# EAGLE design elm329 (EAGLE 7.6.0)
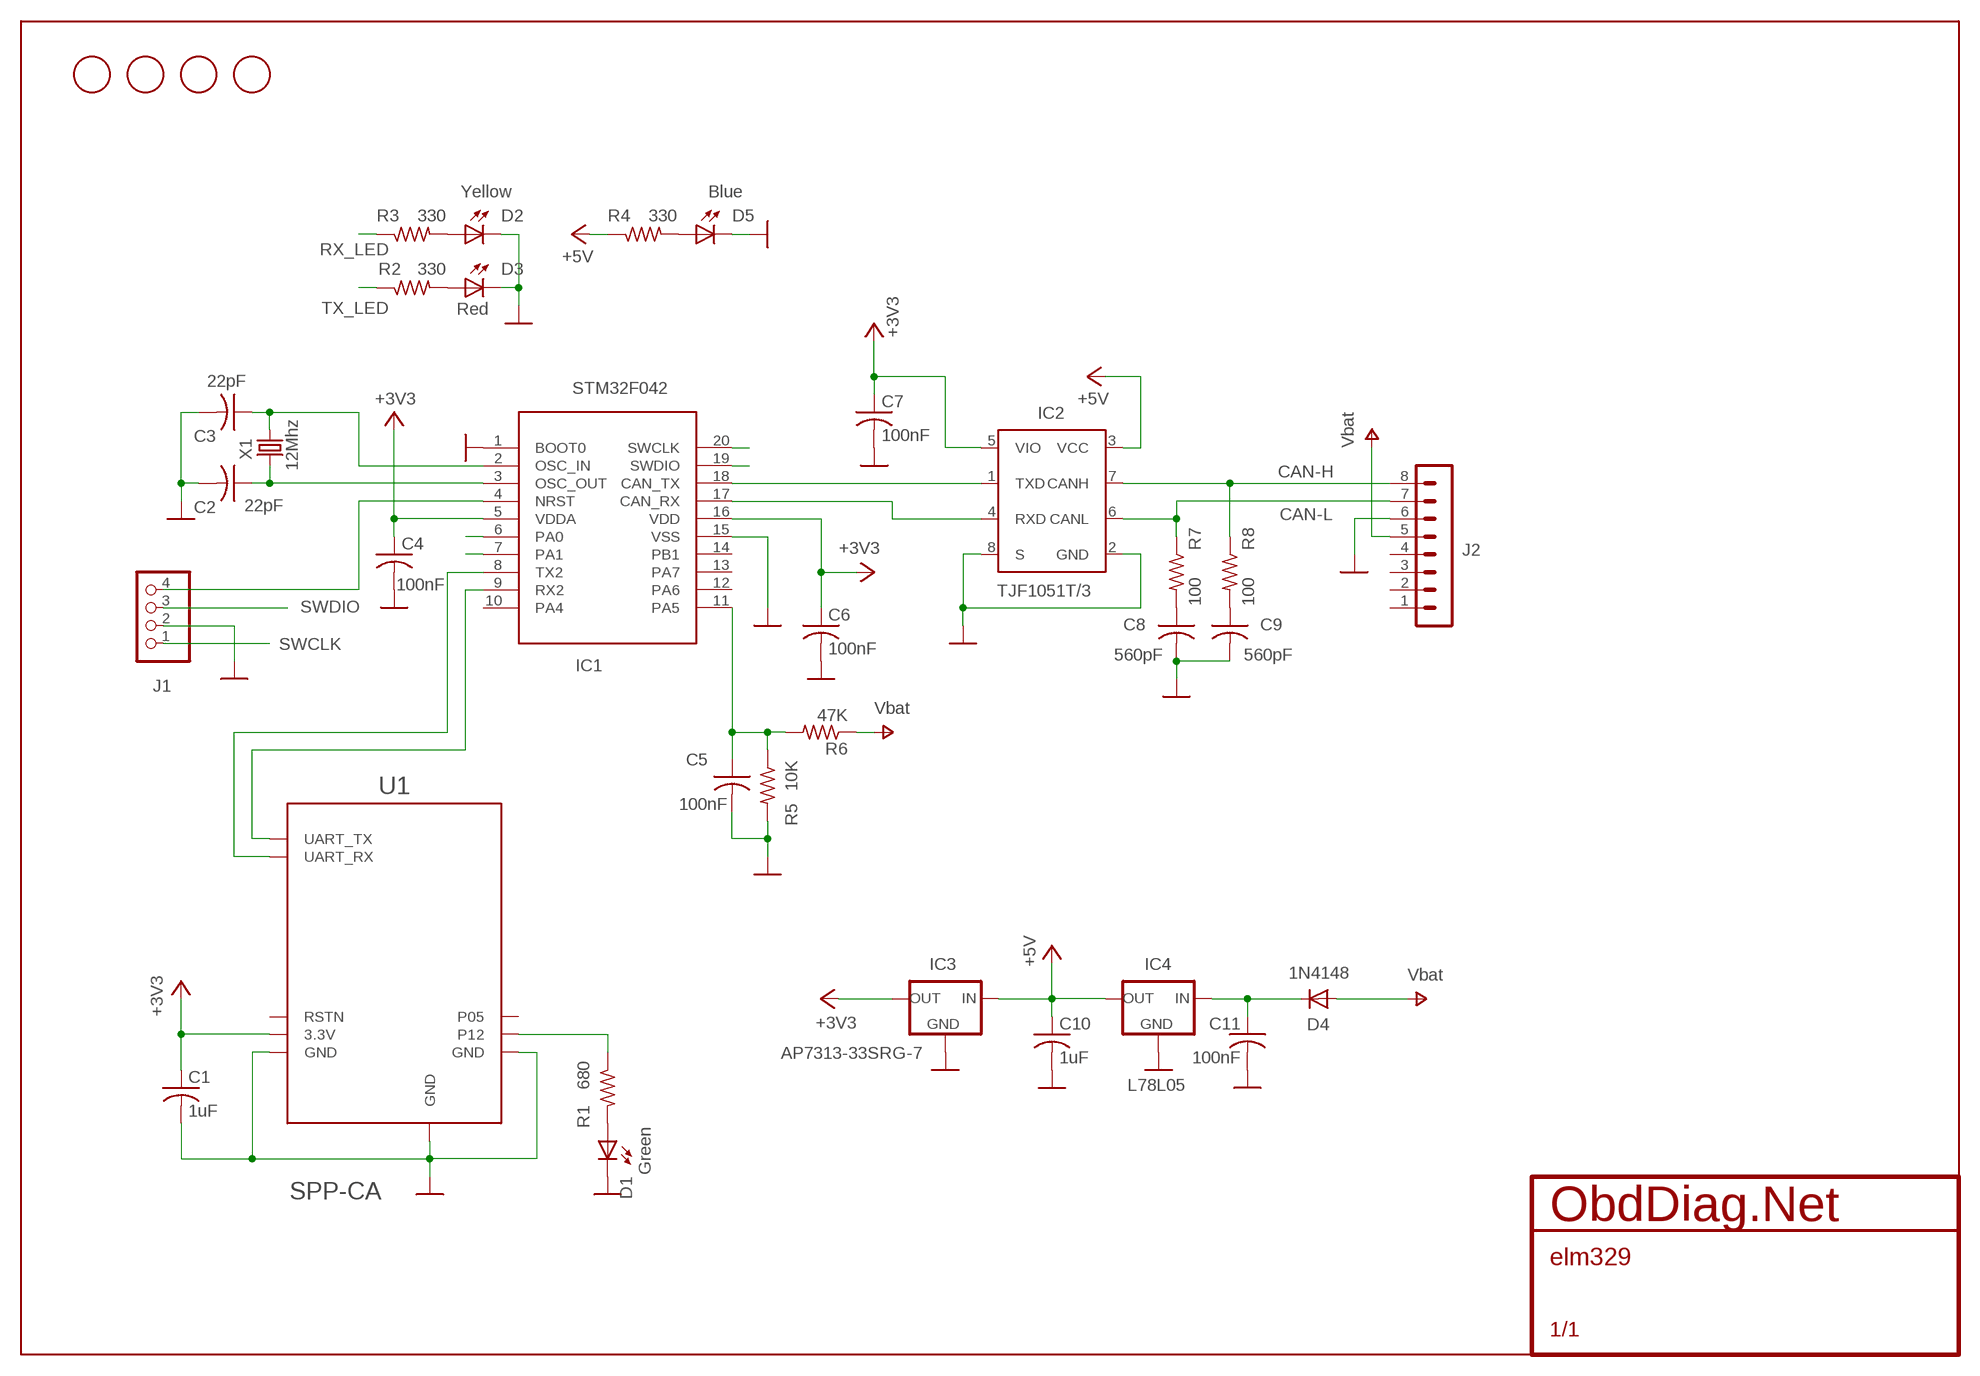
[diagram p0: schematic, sheet 1]

## Parts
C1  1uF  C-USC0805  [C0805]
C2  22pF  C-USC0805  [C0805]
C3  22pF  C-USC0805  [C0805]
C4  100nF  C-USC0805  [C0805]
C5  100nF  C-USC0805  [C0805]
C6  100nF  C-USC0805  [C0805]
C7  100nF  C-USC0805  [C0805]
C8  560pF  C-USC0805  [C0805]
C9  560pF  C-USC0805  [C0805]
C10  1uF  C-USC0805  [C0805]
C11  100nF  C-USC0805  [C0805]
D1  Green  LEDCHIPLED_0805  [CHIPLED_0805]
D2  Yellow  LEDCHIPLED_0805  [CHIPLED_0805]
D3  Red  LEDCHIPLED_0805  [CHIPLED_0805]
D4  1N4148  1N4148W  [SOD123]
D5  Blue  LEDCHIPLED_0805  [CHIPLED_0805]
IC1  STM32F042  STM32F042-TSSOP  [TSSOP20]
IC2  TJF1051T/3  TJF1051  [SO-8]
IC3  AP7313-33SRG-7  MCP1700-SOT23  [SOT23]
IC4  L78L05  L78LXX-SOT89  [SOT89R]
J1  1X04  1X04SMALL  [1X04]
J2  MA08-1  [MA08-1]
R1  680  R-US_R0805  [R0805]
R2  330  R-US_R0805  [R0805]
R3  330  R-US_R0805  [R0805]
R4  330  R-US_R0805  [R0805]
R5  10K  R-US_R0805  [R0805]
R6  47K  R-US_R0805  [R0805]
R7  100  R-US_R0805  [R0805]
R8  100  R-US_R0805  [R0805]
U1  SPP-CA  [HM-10_16]
U$1  FIDUCIAL  [FIDUCIAL_1MM]
U$2  FIDUCIAL  [FIDUCIAL_1MM]
U$4  FIDUCIAL  [FIDUCIAL_1MM]
U$5  FIDUCIAL  [FIDUCIAL_1MM]
X1  12Mhz  CRYSTALSM49  [SM49]

## Nets
+3V3: C1.1 C4.1 C6.1 C7.1 IC1.5(VDDA) IC1.16(VDD) IC2.5(VIO) IC3.2(OUT) U1.12(3.3V)
+5V: C10.1 IC2.3(VCC) IC3.3(IN) IC4.2(OUT) R4.1
CAN-H: IC2.7(CANH) J2.8 R8.1
CAN-L: IC2.6(CANL) J2.7 R7.1
CAN_RX1: IC1.17(CAN_RX) IC2.4(RXD)
GND: C1.2 C2.2 C3.2 C4.2 C5.2 C6.2 C7.2 C8.2 C9.2 C10.2 C11.2 D1.C D2.C D3.C D5.C IC1.1(BOOT0) IC1.15(VSS) IC2.2(GND) IC2.8(S) IC3.1(GND) IC4.4(GND) J1.2 J2.6 R5.2 U1.13(GND) U1.21(GND) U1.22(GND)
N$1: D1.A R1.2
N$2: C2.1 IC1.3(OSC_OUT) X1.2
N$3: IC1.4(NRST) J1.4
N$4: R1.1 U1.24(P12)
N$5: C3.1 IC1.2(OSC_IN) X1.1
N$6: IC1.18(CAN_TX) IC2.1(TXD)
N$7: D5.A R4.2
N$9: IC1.9(RX2) U1.1(UART_TX)
N$10: D2.A R3.2
N$11: D3.A R2.2
N$12: C11.1 D4.C IC4.1(IN)
N$14: IC1.8(TX2) U1.2(UART_RX)
N$16: C9.1 R8.2
N$17: C8.1 R7.2
P0_0: C5.1 IC1.11(PA5) R5.1 R6.2
RX_LED: IC1.7(PA1) R3.1
SWCLK: IC1.20(SWCLK) J1.1
SWDIO: IC1.19(SWDIO) J1.3
TX_LED: IC1.6(PA0) R2.1
V+: D4.A J2.5 R6.1 ; supply symbol labelled Vbat
Unconnected: IC1.10(PA4) IC1.12(PA6) IC1.13(PA7) IC1.14(PB1) J2.1 J2.2 J2.3 J2.4 U1.11(RSTN) U1.25(P05)

## Library data of the parts
C1-C11 = rcl:C-US: CAPACITOR, American symbol
D1-D3 D5 = led:LED: LED OSRAM: - CHIPLED LG R971, LG N971, LY N971, LG Q971, LY Q971, LO R971, LY R971 LH N974, LH R974 LS Q976, LO Q976, LY Q976 LO Q996 - Hyper CHIPLED LW Q18S LB Q993, LB Q99A, LB R99A - SideLED LS A670, LO A670, LY A670, LG A670, LP A670 LB A673, LV A673, LT A673, LW A673 LH A674 LY A675 LS A676, LA A676, LO A676, LY A676, LW A676 LS A679, LY A679, LG A679 - Hyper Micro SIDELED® LS Y876, LA Y876, LO Y876, LY Y876 LT Y87S - SmartLED LW L88C, LW L88S LB L89C, LB L89S, LG L890 LS L89K, LO L89K, LY L89K LS L896, LA L896, LO L896, LY L896 - TOPLED LS T670, LO T670, LY T670, LG T670, LP T670 LSG T670, LSP T670, LSY T670, LOP T670, LYG T670 LG T671, LOG T671, LSG T671 LB T673, LV T673, LT T673, LW T673 LH T674 LS T676, LA T676, LO T676, LY T676, LB T676, LH T676, LSB T676, LW T676 LB T67C, LV T67C, LT T67C, LS T67K, LO T67K, LY T67K, LW E67C LS E67B, LA E67B, LO E67B, LY E67B, LB E67C, LV E67C, LT E67C LW T67C LS T679, LY T679, LG T679 LS T770, LO T770, LY T770, LG T770, LP T770 LB T773, LV T773, LT T773, LW T773 LH T774 LS E675, LA E675, LY E675, LS T675 LS T776, LA T776, LO T776, LY T776, LB T776 LHGB T686 LT T68C, LB T68C - Hyper Mini TOPLED® LB M676 - Mini TOPLED Santana® LG M470 LS M47K, LO M47K, LY M47K Source: http://www.osram.convergy.de LUXEON: - LUMILED® LXK2-PW12-R00, LXK2-PW12-S00, LXK2-PW14-U00, LXK2-PW14-V00 LXK2-PM12-R00, LXK2-PM12-S00, LXK2-PM14-U00 LXK2-PE12-Q00, LXK2-PE12-R00, LXK2-PE12-S00, LXK2-PE14-T00, LXK2-PE14-U00 LXK2-PB12-K00, LXK2-PB12-L00, LXK2-PB12-M00, LXK2-PB14-N00, LXK2-PB14-P00, LXK2-PB14-Q00 LXK2-PR12-L00, LXK2-PR12-M00, LXK2-PR14-Q00, LXK2-PR14-R00 LXK2-PD12-Q00, LXK2-PD12-R00, LXK2-PD12-S00 LXK2-PH12-R00, LXK2-PH12-S00 LXK2-PL12-P00, LXK2-PL12-Q00, LXK2-PL12-R00 Source: www.luxeon.com KINGBRIGHT: KA-3528ASYC Source: www.kingbright.com
D4 = obddiag-net:1N4148W
IC1 = st:STM32F042-TSSOP
IC2 = obddiag-net:TJF1051
IC3 = obddiag-net:MCP1700
IC4 = obddiag-net:L78LXX-SOT89
J1 = obddiag-net:1X04
J2 = obddiag-net:MA08-1
R1-R8 = rcl:R-US_: RESISTOR, American symbol
U1 = obddiag-net:SPP-CA
U$1 U$2 U$4 U$5 = adafruit:FIDUCIAL: For use by pick and place machines to calibrate the vision/machine, 1mm By microbuilder.eu
X1 = crystal:CRYSTAL: CRYSTAL; OC_FARNELL: unknown; OC_NEWARK: unknown

## Board
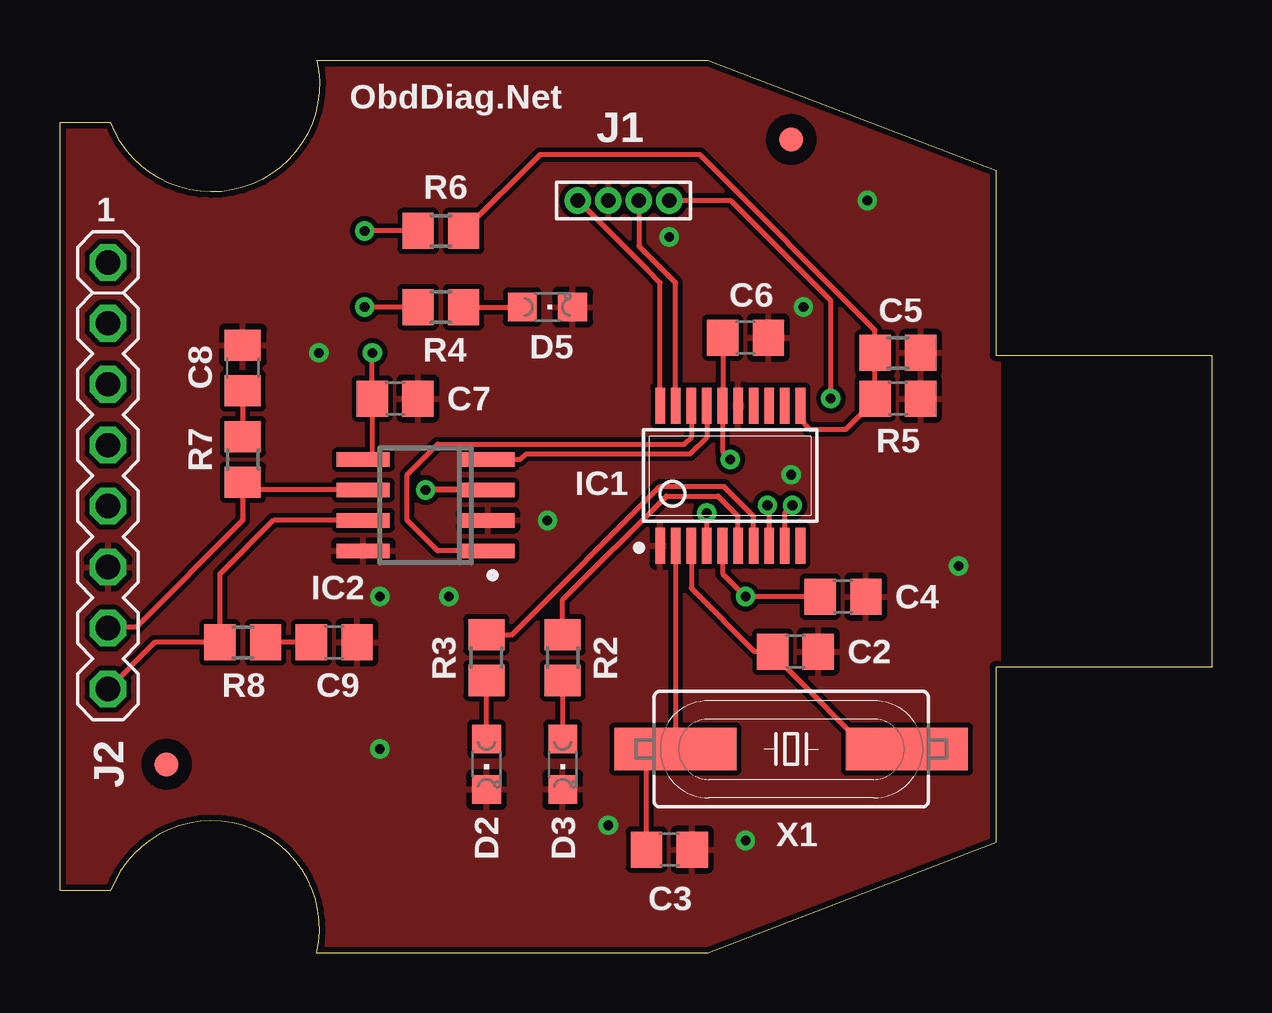
[diagram p1: board, top side]
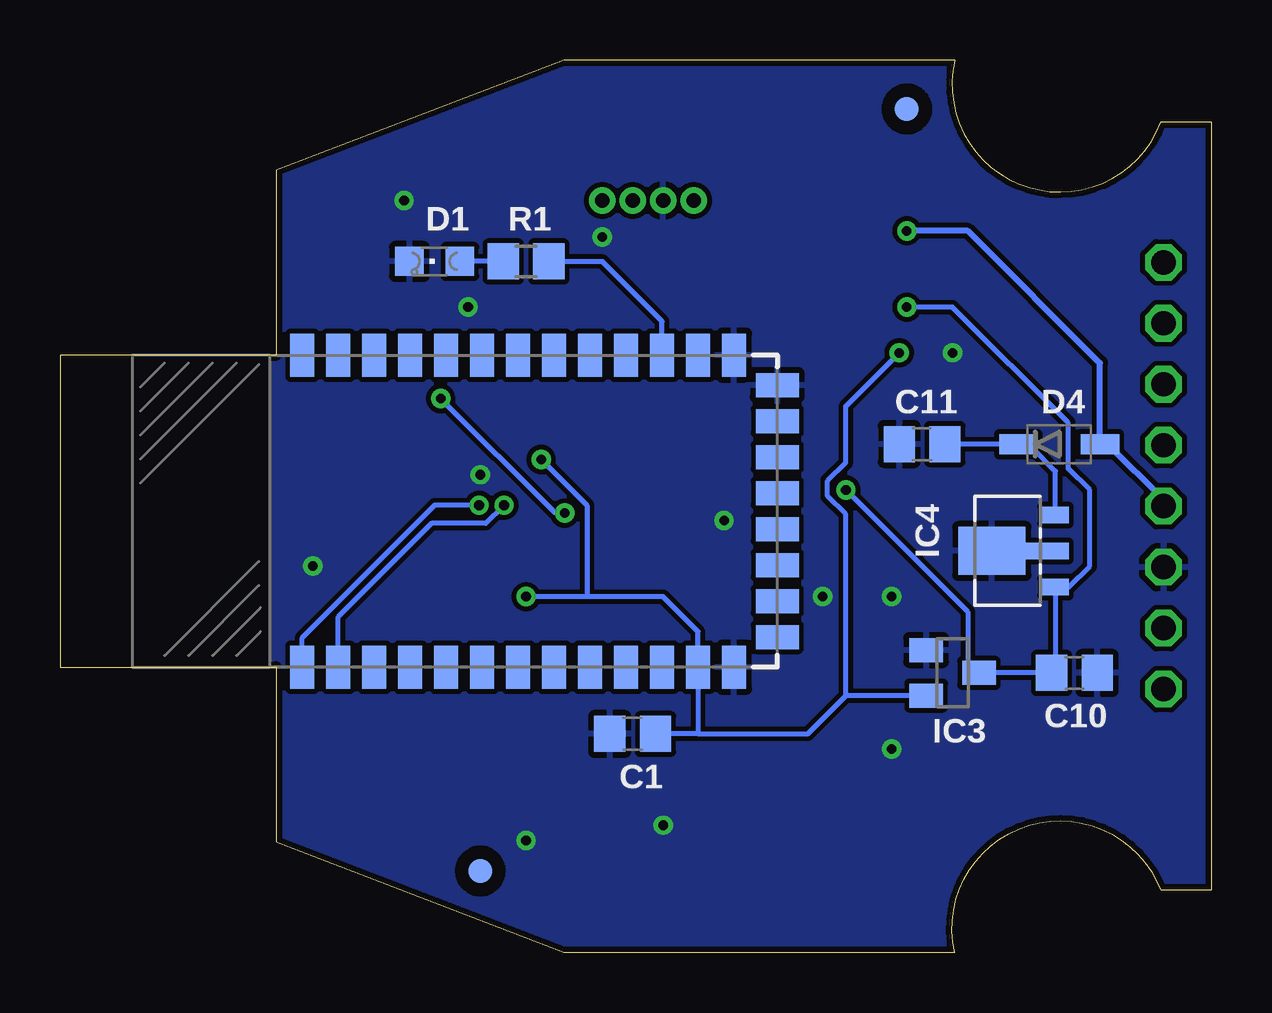
[diagram p2: board, bottom side, seen from below]

Size 48 x 37.2 mm. Coordinates in mm from the lower left corner, seen from the top.
Outline: 10.71,0 27,0 39,4.6 39,11.9 48,11.9 48,24.9 39,24.9 39,32.6 27,37.2 10.71,37.2 arc-172 2.11,34.6 0,34.6 0,2.6 2.11,2.6 arc-172 10.71,0
Copper layers (1*16): Top 1mil / dielectric 20mil / Bottom 1mil
Design rules "default *": minimum track width 8mil, minimum drill 0.4mm, track to track 8mil, track to pad 8mil, pad to pad 5mil, via to via 8mil, smd to smd 5mil, copper to edge 10mil, drill to drill 8mil, minimum pad ring 10mil, minimum via ring 8mil, stop-mask expansion 4mil, vias tented up to drill 0mil, thermal gap 10mil
tRestrict: area 39.2,11.9 to 45,24.9

### Footprints (pad centres in the part's own frame; a part is rotated, then mirrored left to right if it is on the bottom)
C0805 = smd 1.3 x 1.5: 1 -0.95,0; 2 0.95,0
CHIPLED_0805 = smd 1.2 x 1.2: A 0,-1.05; C 0,1.05
SOD123 = smd 1.6 x 0.85: A 1.7,0; C -1.7,0
TSSOP20 = smd 0.4 x 1.5: 1 -2.925,-2.915; 2 -2.275,-2.915; 3 -1.625,-2.915; 4 -0.975,-2.915; 5 -0.325,-2.915; 6 0.325,-2.915; 7 0.975,-2.915; 8 1.625,-2.915; 9 2.275,-2.915; 10 2.925,-2.915; 11 2.925,2.915; 12 2.275,2.915; 13 1.625,2.915; 14 0.975,2.915; 15 0.325,2.915; 16 -0.325,2.915; 17 -0.975,2.915; 18 -1.625,2.915; 19 -2.275,2.915; 20 -2.925,2.915
SO-8 = smd 0.6 x 2.2: 1 -1.905,-2.6; 2 -0.635,-2.6; 3 0.635,-2.6; 4 1.905,-2.6; 5 1.905,2.6; 6 0.635,2.6; 7 -0.635,2.6; 8 -1.905,2.6
SOT23 = smd 1 x 1.4: 1 -0.95,-1.1; 2 0.95,-1.1; 3 0,1.1
SOT89R = smd 0.7 x 1.1: 1 1.5,-1.75; 2 -1.5,-1.75 | smd 0.7 x 1.8: 3 0,-1.4 | smd 2 x 2.8: 4 0,0.9
1X04 = drill 0.6 pad 1.016: 1 -1.905,0; 2 -0.635,0; 3 0.635,0; 4 1.905,0
MA08-1 = drill 1.016 octagon: 1 -8.89,0; 2 -6.35,0; 3 -3.81,0; 4 -1.27,0; 5 1.27,0; 6 3.81,0; 7 6.35,0; 8 8.89,0
R0805 = smd 1.3 x 1.5: 1 -0.95,0; 2 0.95,0
HM-10_16 = smd 1 x 1.8: 1 7.1,-6.5; 2 8.6,-6.5; 3 10.1,-6.5; 4 11.6,-6.5; 5 13.1,-6.5; 6 14.6,-6.5; 7 16.1,-6.5; 8 17.6,-6.5; 9 19.1,-6.5; 10 20.6,-6.5; 11 22.1,-6.5; 12 23.6,-6.5; 13 25.1,-6.5; 22 25.1,6.5; 23 23.6,6.5; 24 22.1,6.5; 25 20.6,6.5; 26 19.1,6.5; 27 17.6,6.5; 28 16.1,6.5; 29 14.6,6.5; 30 13.1,6.5; 31 11.6,6.5; 32 10.1,6.5; 33 8.6,6.5; 34 7.1,6.5 | smd 1.8 x 1: 14 26.9,-5.25; 15 26.9,-3.75; 16 26.9,-2.25; 17 26.9,-0.75; 18 26.9,0.75; 19 26.9,2.25; 20 26.9,3.75; 21 26.9,5.25
FIDUCIAL_1MM = smd 1 x 1: 1 0,0
SM49 = smd 5.08 x 1.778: 1 -4.826,0; 2 4.826,0

### Placement (x,y rotation side)
C1  24.13,9.12 180 bottom
C2  30.66,12.55 0 top
C3  25.4,4.3 0 top
C4  32.64,14.84 0 top
C5  34.92,23.1 0 top
C6  28.57,25.64 0 top
C7  13.97,23.1 0 top
C8  7.62,24.37 90 top
C9  11.43,12.94 0 top
C10  5.71,11.66 0 bottom
C11  12.06,21.19 180 bottom
D1  32.38,28.81 90 bottom
D2  17.78,7.86 180 top
D3  20.95,7.86 180 top
D4  6.35,21.19 0 bottom
D5  20.32,26.91 270 top
IC1  27.94,19.88 0 top
IC2  15.24,18.65 90 top
IC3  10.79,11.66 270 bottom
IC4  8.26,16.75 90 bottom
J1  23.5,31.35 0 top
J2  2,19.88 270 top
R1  28.57,28.81 180 bottom
R2  20.95,12.3 270 top
R3  17.78,12.3 270 top
R4  15.88,26.91 0 top
R5  34.92,25 0 top
R6  15.88,30.08 0 top
R7  7.62,20.55 90 top
R8  7.62,12.94 0 top
U1  45,18.4 0 bottom
U$1  30.48,33.89 261.6 top
U$2  4.45,7.86 0 top
U$4  12.7,35.16 0 bottom
U$5  30.48,3.41 0 bottom
X1  30.48,8.49 0 top

### Tracks (layer width: path | path; a pad name or v marks a point on that pad's centre or on a via)
+3V3  (via drill 0.4)
  Top 0.203: 13.02,20.55 C7.1 v13.02,25 | 13.34,20.55 13.02,20.55 | 13.02,20.55 IC2.5 | IC1.5 27.61,15.8 v28.57,14.84 C4.1 | C6.1 IC1.16 27.61,20.88 v27.94,20.55
  Bottom 0.203: 21.4,9.12 U1.12 21.4,13.38 22.86,14.84 26.04,14.84 | IC3.2 15.24,10.71 | 21.4,9.12 C1.1 23.5,8.81 | 21.4,9.12 16.83,9.12 15.24,10.71 | v13.02,25 15.24,22.78 15.24,20.43 16,19.67 16,19.03 15.24,18.27 15.24,10.71 | 26.04,14.84 v28.57,14.84 | 26.04,14.84 26.04,18.65 v27.94,20.55
+5V  (via drill 0.4)
  Top 0.203: R4.1 v12.7,26.91
  Top 0.254: IC2.3 v15.24,19.29
  Bottom 0.203: v12.7,26.91 10.79,26.91 5.97,22.08 5.97,20.17 5.08,19.29 5.08,16.11 5.95,15.24 IC4.2 6.5,11.82 C10.1 9.02,11.66 9.27,11.92 9.44,11.92 IC3.3 10.16,12.13 10.16,14.21 v15.24,19.29
CAN-H
  Top 0.203: J2.8 3.94,12.94 R8.1 6.67,15.79 8.89,18.02 IC2.7
CAN-L
  Top 0.203: IC2.6 7.94,19.29 R7.1 7.62,18.02 3.17,13.57 2.04,13.57 J2.7
CAN_RX1
  Top 0.203: IC1.17 26.96,21.49 26.26,20.78 19.43,20.78 19.18,20.55 IC2.4
GND  (via drill 0.4)
  other vias: 33.66,31.35 13.34,8.49 28.57,4.68 22.86,5.31 16.21,14.84 13.34,14.84 10.79,25 37.47,16.11 30.48,19.92 30.99,26.91 20.32,18.02 25.4,29.83
  pour Bottom: 0,2.6 10.16,2.6 10.16,0 48,0 48,37.2 10.16,37.2 10.16,34.6 0,34.6
  pour Top: 0,2.6 10.16,2.6 10.16,0 48,0 48,37.2 10.16,37.2 10.16,34.6 0,34.6
N$1
  Bottom 0.203: R1.2 D1.A
N$2
  Top 0.203: X1.2 33.66,8.49 30.29,11.85 C2.1 28.96,12.55 26.32,15.2 IC1.3
N$3  (via drill 0.4)
  Top 0.203: IC1.4 v26.96,18.32 | J1.4 27.94,31.35 32.13,27.16 v32.13,23.1
  Bottom 0.203: v26.96,18.32 27.39,18.36 v32.13,23.1
N$4
  Bottom 0.203: U1.24 22.9,26.31 25.4,28.81 R1.1
N$5
  Top 0.203: 25.3,8.84 X1.1 | C3.1 24.45,8.17 24.13,8.49 X1.1 | IC1.2 25.66,8.86 | 25.66,8.86 26.04,8.49 | 25.66,8.86 25.66,8.5 X1.1
N$6
  Top 0.203: IC2.1 15.75,16.75 14.48,18.02 14.48,19.92 15.75,21.19 26.04,21.19 26.32,21.47 IC1.18
N$7
  Top 0.203: R4.2 D5.A
N$9  (via drill 0.4)
  Top 0.203: IC1.9 30.21,18.33 v30.53,18.65
  Bottom 0.203: v30.53,18.65 32.38,18.65 37.9,13.13 U1.1
N$10
  Top 0.203: D2.A R3.2
N$11
  Top 0.203: R2.2 D3.A
N$12
  Bottom 0.203: C11.1 D4.C 7.92,21.06 7.49,21.06 6.5,20.08 IC4.1
N$14  (via drill 0.4)
  Top 0.203: IC1.8 29.57,18.57 v29.49,18.65
  Bottom 0.203: U1.2 36.4,14 32.51,17.89 30.25,17.89 v29.49,18.65
N$16
  Top 0.203: C9.1 R8.2
N$17
  Top 0.203: C8.1 R7.2
P0_0
  Top 0.203: C5.1 R5.1 33.98,25.95 26.67,33.26 20,33.26 R6.2 | 33.74,22.86 C5.1 | 33.67,22.8 C5.1 | C5.1 33.53,22.65 33.53,22.59 32.77,21.83 31.24,21.83 30.86,22.2 IC1.11
RX_LED
  Top 0.203: R3.1 18.86,13.25 18.86,13.28 25.02,19.44 27.69,19.44 27.69,19.41 28.91,18.18 IC1.7
SWCLK
  Top 0.203: J1.1 24.13,28.81 24.5,28.44 25.02,27.93 IC1.20
SWDIO
  Top 0.203: J1.3 24.13,29.45 25.66,27.91 IC1.19
TX_LED
  Top 0.203: IC1.6 28.27,18.2 27.43,19.03 25.27,19.03 20.95,14.71 R2.1
V+  (via drill 0.4)
  Top 0.203: R6.1 v12.7,30.08
  Bottom 0.203: D4.A 4.32,21.19
  Bottom 0.254: v12.7,30.08 10.16,30.08 4.65,24.57 D4.A 4.52,21.06 | J2.5 2,18.87 4.32,21.19

### Text on the board
tNames: ObdDiag.Net | J1 | 1